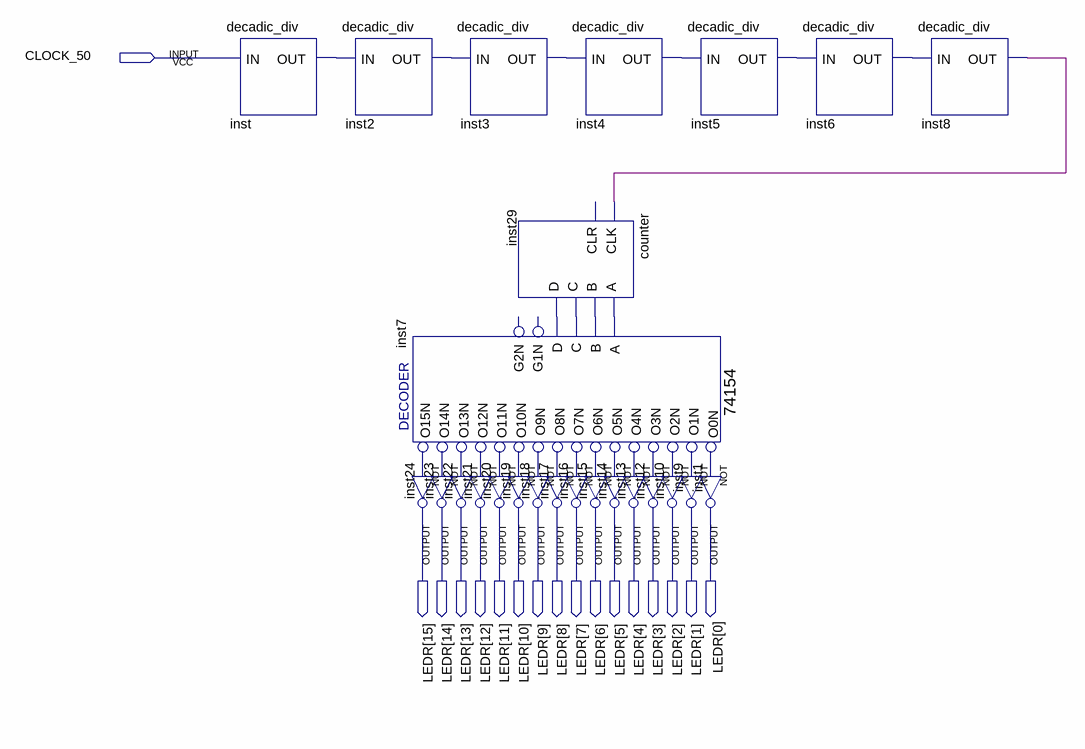
[diagram p0: schematic sheet]
// Quartus schematic had_10.bdf as structural Verilog: 25 symbols, 17 pins
module had_10 (
  input  CLOCK_50,
  output [15:0] LEDR
);

  wire inst2_out, inst3_out, inst4_out, inst5_out, inst6_out, inst7_o0n, inst7_o1n, inst7_o2n, inst7_o3n,
       inst7_o4n, inst7_o5n, inst7_o6n, inst7_o7n, inst7_o8n, inst7_o9n, inst7_o10n, inst7_o11n, inst7_o12n,
       inst7_o13n, inst7_o14n, inst7_o15n, inst8_out, inst29_a, inst29_b, inst29_c, inst29_d, inst_out;

  decadic_div inst (.IN(CLOCK_50), .OUT(inst_out));
  decadic_div inst2 (.IN(inst_out), .OUT(inst2_out));
  \74154  inst7 (
    .C(inst29_c), .D(inst29_d), .B(inst29_b), .A(inst29_a), .O0N(inst7_o0n), .O12N(inst7_o12n),
    .O15N(inst7_o15n), .O10N(inst7_o10n), .O11N(inst7_o11n), .O1N(inst7_o1n), .O13N(inst7_o13n),
    .O14N(inst7_o14n), .O4N(inst7_o4n), .O3N(inst7_o3n), .O2N(inst7_o2n), .O7N(inst7_o7n), .O6N(inst7_o6n),
    .O5N(inst7_o5n), .O9N(inst7_o9n), .O8N(inst7_o8n));  // open: G1N, G2N
  not inst24 (LEDR[15], inst7_o15n);
  decadic_div inst3 (.IN(inst2_out), .OUT(inst3_out));
  not inst20 (LEDR[11], inst7_o11n);
  not inst21 (LEDR[12], inst7_o12n);
  not inst22 (LEDR[13], inst7_o13n);
  not inst23 (LEDR[14], inst7_o14n);
  decadic_div inst4 (.IN(inst3_out), .OUT(inst4_out));
  counter inst29 (.CLK(inst8_out), .A(inst29_a), .B(inst29_b), .C(inst29_c), .D(inst29_d));  // open: CLR
  not inst16 (LEDR[7], inst7_o7n);
  not inst17 (LEDR[8], inst7_o8n);
  not inst18 (LEDR[9], inst7_o9n);
  not inst19 (LEDR[10], inst7_o10n);
  not inst12 (LEDR[3], inst7_o3n);
  not inst13 (LEDR[4], inst7_o4n);
  not inst14 (LEDR[5], inst7_o5n);
  not inst15 (LEDR[6], inst7_o6n);
  decadic_div inst5 (.IN(inst4_out), .OUT(inst5_out));
  not inst1 (LEDR[0], inst7_o0n);
  not inst9 (LEDR[1], inst7_o1n);
  not inst10 (LEDR[2], inst7_o2n);
  decadic_div inst6 (.IN(inst5_out), .OUT(inst6_out));
  decadic_div inst8 (.IN(inst6_out), .OUT(inst8_out));
endmodule
